# Altium project MainBoard.PrjPcb
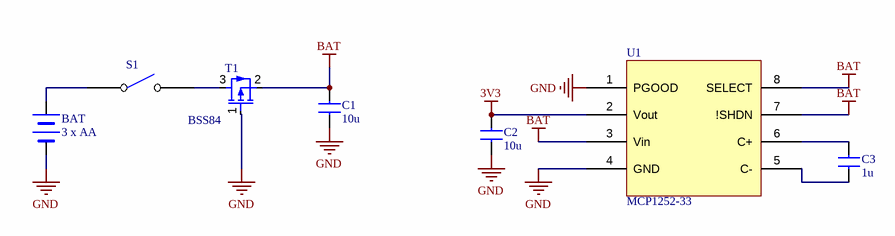
[diagram p0: MainBoard_Power.SchDoc]
5 sheets, 55 parts. Net scope: global (net labels, ports and power ports of the same name join across sheets).
Board file: MainBoard.PcbDoc
Sheets:
  MainBoard_Power.SchDoc
  MainBoard_MCU_RF.SchDoc
  MainBoard_HMI.SchDoc
  MainBoard_Light.SchDoc
  MainBoard_Interface_ProyimityDetector.SchDoc

## Sheet MainBoard_Power.SchDoc: Main Board Power
size A4; DrawnBy: M. Schwegler; Organization: HSLU T&A; Address1: Abteilung Elektrotechnik; Address2: Technikumsstrasse 21; Address3: CH-6048 Horw; Revision: v2; SheetNumber: 1; SheetTotal: 5; Projektname: SmartBoard; DocumentName: Main Board Power

### Parts
BAT  3 x AA  [POWER2]
C1  10u  [0805_C]
C2  10u  [0805_C]
C3  1u  [0805_C]
S1  SW SPST  [SIP2]  (value not drawn)
T1  BSS84  [SOT23-3]
U1  MCP1252-33  [MSOP8]

### Nets
3V3: C2.2 U1.2(Vout)
BAT: C1.2 T1.2(S) U1.3(Vin) U1.7(!SHDN) U1.8(SELECT)
GND: BAT.2 C1.1 C2.1 T1.1(G) U1.1(PGOOD) U1.4(GND)
NetBAT_1: BAT.1 S1.1(COMMON)
NetC3_1: C3.1 U1.5(C-)
NetC3_2: C3.2 U1.6(C+)
NetS1_2: S1.2(NO) T1.3(D)

### Notes on the sheet
- Project:
- Drawn by:
- Size:
- Sheet
- A4
- Rev.:
- of
- Date:
- File:

### Library data of the parts
BAT = BATTERY
C1-C3 = C?: Normaler Kondensator
T1 = MOSFET-P 1G,2D,3S (Diode)
U1 = VOLTREG

## Sheet MainBoard_MCU_RF.SchDoc: Main Board MCU and nRF24L01+
size A4; DrawnBy: M. Schwegler; Organization: HSLU T&A; Address1: Abteilung Elektrotechnik; Address2: Technikumsstrasse 21; Address3: CH-6048 Horw; Revision: v2; SheetNumber: 2; SheetTotal: 5; Projektname: SmartBoard; DocumentName: MainBoard; ProjectName: SmartBoard
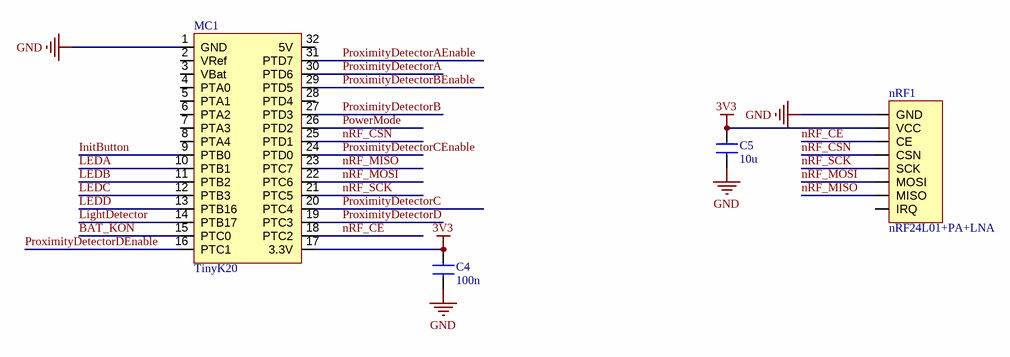
[diagram p1: MainBoard_MCU_RF.SchDoc]

### Parts
C4  100n  [0805_C]
C5  10u  [0805_C]
MC1  TinyK20  [DIP32]
nRF1  nRF24L01+PA+LNA  [CON_THT_2x4P_RM2.54_Stiftl]

### Nets
3V3: C4.2 C5.2 MC1.17(3.3V) nRF1.2(VCC)
GND: C4.1 C5.1 MC1.1(GND) nRF1.1(GND)
BAT_KON: MC1.15(PTC0)
InitButton: MC1.9(PTB0)
LEDA: MC1.10(PTB1)
LEDB: MC1.11(PTB2)
LEDC: MC1.12(PTB3)
LEDD: MC1.13(PTB16)
LightDetector: MC1.14(PTB17)
nRF_CE: MC1.18(PTC2) nRF1.3(CE)
nRF_CSN: MC1.25(PTD1) nRF1.4(CSN)
nRF_MISO: MC1.23(PTC7) nRF1.7(MISO)
nRF_MOSI: MC1.22(PTC6) nRF1.6(MOSI)
nRF_SCK: MC1.21(PTC5) nRF1.5(SCK)
PowerMode: MC1.26(PTD2)
ProximityDetectorA: MC1.30(PTD6)
ProximityDetectorAEnable: MC1.31(PTD7)
ProximityDetectorB: MC1.27(PTD3)
ProximityDetectorBEnable: MC1.29(PTD5)
ProximityDetectorC: MC1.20(PTC4)
ProximityDetectorCEnable: MC1.24(PTD0)
ProximityDetectorD: MC1.19(PTC3)
ProximityDetectorDEnable: MC1.16(PTC1)

Not connected (* = marked no-connect by the designer): MC1 2(VRef) 3(VBat) 4(PTA0) 5(PTA1) 6(PTA2) 7(PTA3) 8(PTA4) 28(PTD4) 32(5V); nRF1 8(IRQ)

### Notes on the sheet
- Project:
- Drawn by:
- Size:
- Sheet
- A4
- Rev.:
- of
- Date:
- File:

### Library data of the parts
C4 C5 = C?: Normaler Kondensator
nRF1 = Bluefruit

## Sheet MainBoard_HMI.SchDoc: Main Board HMI
size A4; DrawnBy: M. Schwegler; Organization: HSLU T&A; Address1: Abteilung Elektrotechnik; Address2: Technikumsstrasse 21; Address3: CH-6048 Horw; Revision: v2; SheetNumber: 3; SheetTotal: 5; Projektname: SmartBoard; DocumentName: MainBoard; ProjectName: SmartBoard
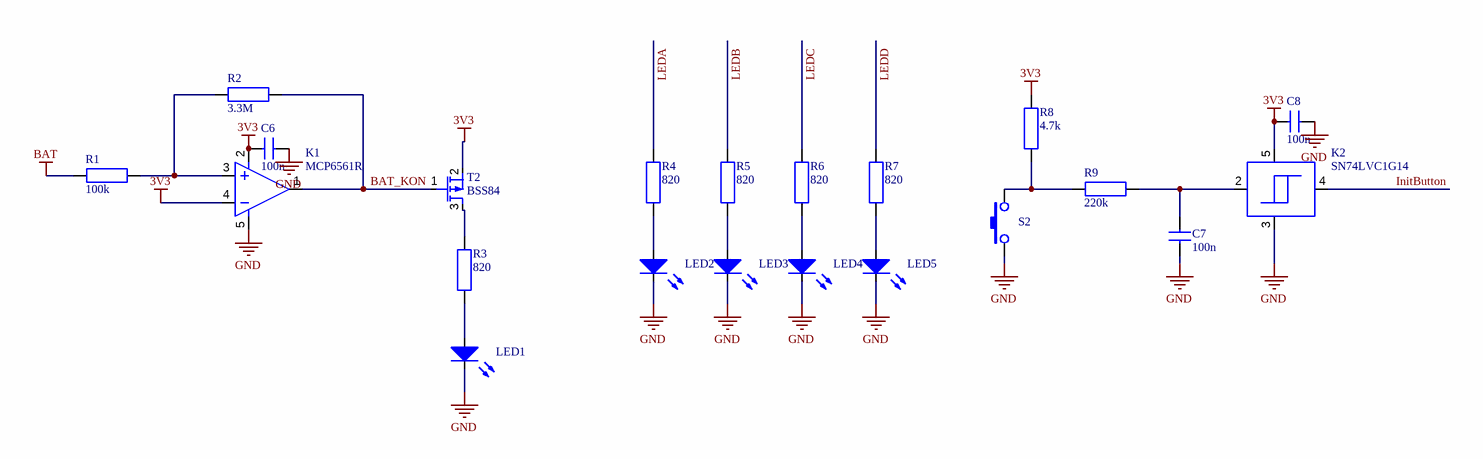
[diagram p2: MainBoard_HMI.SchDoc]

### Parts
C6  100n  [0805_C]
C7  100n  [0805_C]
C8  100n  [0805_C]
K1  MCP6561R  [SOT23-5]
K2  SN74LVC1G14  [SOT23-5]
LED1  (no value)  [LED_THT_3mm_RM_2.54mm]
LED2  (no value)  [LED_THT_3mm_RM_2.54mm]
LED3  (no value)  [LED_THT_3mm_RM_2.54mm]
LED4  (no value)  [LED_THT_3mm_RM_2.54mm]
LED5  (no value)  [LED_THT_3mm_RM_2.54mm]
R1  100k  [0805_R]
R2  3.3M  [0805_R]
R3  820  [0805_R]
R4  820  [0805_R]
R5  820  [0805_R]
R6  820  [0805_R]
R7  820  [0805_R]
R8  4.7k  [0805_R]
R9  220k  [0805_r]
S2  S2  [SIP2]  (value not drawn)
T2  BSS84  [SOT23-3]

### Nets
3V3: C6.1 C8.1 K1.2 K1.4 K2.5 R8.1 T2.2(S)
BAT: R1.2
GND: C6.2 C7.1 C8.2 K1.5 K2.3 LED1.2(K) LED2.2(K) LED3.2(K) LED4.2(K) LED5.2(K) S2.1
BAT_KON: K1.1 R2.1 T2.1(G)
InitButton: K2.4
LEDA: R4.1
LEDB: R5.1
LEDC: R6.1
LEDD: R7.1
NetC7_2: C7.2 K2.2 R9.2
NetK1_3: K1.3 R1.1 R2.2
NetLED1_1: LED1.1(A) R3.2
NetLED2_1: LED2.1(A) R4.2
NetLED3_1: LED3.1(A) R5.2
NetLED4_1: LED4.1(A) R6.2
NetLED5_1: LED5.1(A) R7.2
NetR3_1: R3.1 T2.3(D)
NetR8_2: R8.2 R9.1 S2.2

### Notes on the sheet
- Project:
- Drawn by:
- Size:
- Sheet
- A4
- Rev.:
- of
- Date:
- File:

### Library data of the parts
C6-C8 = C?: Normaler Kondensator
K1 = OPAMP
K2 = schmitt
LED1-LED5 = LED
R1-R9 = R?: Normaler Widerstand
S2 = SW-PB
T2 = MOSFET-P 1D,2G,3S

## Sheet MainBoard_Light.SchDoc: Main Board Light Detector
size A4; DrawnBy: M. Schwegler; Organization: HSLU T&A; Address1: Abteilung Elektrotechnik; Address2: Technikumsstrasse 21; Address3: CH-6048 Horw; Revision: v2; SheetNumber: 4; SheetTotal: 5; Projektname: SmartBoard; DocumentName: MainBoard; ProjectName: SmartBoard
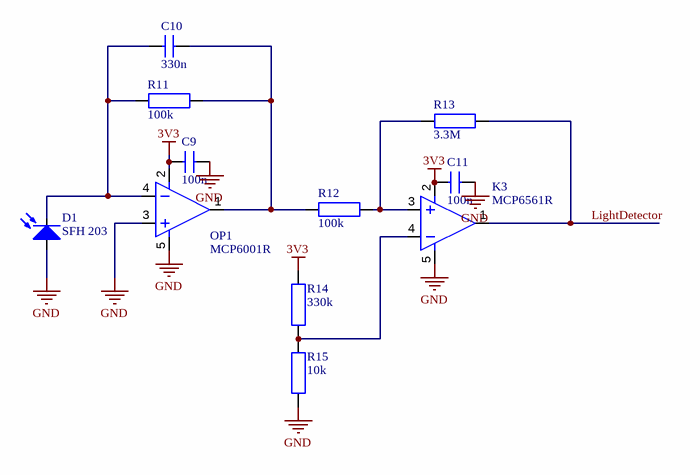
[diagram p3: MainBoard_Light.SchDoc]

### Parts
C9  100n  [0805_C]
C10  330n  [0805_C]
C11  100n  [0805_C]
D1  SFH 203  [LED_THT_5mm_RM_2.54mm]
K3  MCP6561R  [SOT23-5]
OP1  MCP6001R  [SOT23-5]
R11  100k  [0805_R]
R12  100k  [0805_R]
R13  3.3M  [0805_R]
R14  330k  [0805_R]
R15  10k  [0805_R]

### Nets
3V3: C9.1 C11.1 K3.2 OP1.2 R14.1
GND: C9.2 C11.2 D1.1(A) K3.5 OP1.3 OP1.5 R15.2
LightDetector: K3.1 R13.1
NetC10_1: C10.1 D1.2(K) OP1.4 R11.2
NetC10_2: C10.2 OP1.1 R11.1 R12.2
NetK3_3: K3.3 R12.1 R13.2
NetK3_4: K3.4 R14.2 R15.1

### Notes on the sheet
- Project:
- Drawn by:
- Size:
- Sheet
- A4
- Rev.:
- of
- Date:
- File:

### Library data of the parts
C9-C11 = C?: Normaler Kondensator
D1 = Photo_Diode_1A_2K
K3 OP1 = OPAMP
R11-R15 = R?: Normaler Widerstand

## Sheet MainBoard_Interface_ProyimityDetector.SchDoc: Main Board Interface Proximity Detector
size A4; DrawnBy: M. Schwegler; Organization: HSLU T&A; Address1: Abteilung Elektrotechnik; Address2: Technikumsstrasse 21; Address3: CH-6048 Horw; Revision: v2; SheetNumber: 5; SheetTotal: 5; Projektname: SmartBoard; DocumentName: MainBoard; ProjectName: SmartBoard
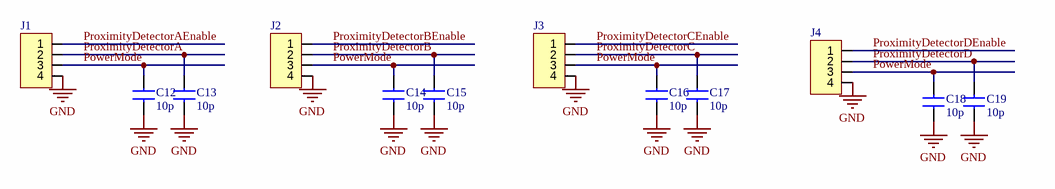
[diagram p4: MainBoard_Interface_ProyimityDetector.SchDoc]

### Parts
C12  10p  [0805_C]
C13  10p  [0805_C]
C14  10p  [0805_C]
C15  10p  [0805_C]
C16  10p  [0805_C]
C17  10p  [0805_C]
C18  10p  [0805_C]
C19  10p  [0805_C]
J1  (no value)  [CON_THT_4P_RM2.54]
J2  (no value)  [CON_THT_4P_RM2.54]
J3  (no value)  [CON_THT_4P_RM2.54]
J4  (no value)  [CON_THT_4P_RM2.54]

### Nets
GND: C12.1 C13.1 C14.1 C15.1 C16.1 C17.1 C18.1 C19.1 J1.4 J2.4 J3.4 J4.4
PowerMode: C12.2 C14.2 C16.2 C18.2 J1.3 J2.3 J3.3 J4.3
ProximityDetectorA: C13.2 J1.2
ProximityDetectorAEnable: J1.1
ProximityDetectorB: C15.2 J2.2
ProximityDetectorBEnable: J2.1
ProximityDetectorC: C17.2 J3.2
ProximityDetectorCEnable: J3.1
ProximityDetectorD: C19.2 J4.2
ProximityDetectorDEnable: J4.1

### Notes on the sheet
- Project:
- Drawn by:
- Size:
- Sheet
- A4
- Rev.:
- of
- Date:
- File:

### Library data of the parts
C12-C19 = C?: Normaler Kondensator
J1-J4 = CON_4P

## Nets that join several sheets
3V3: MainBoard_Power (C2.2 U1.2), MainBoard_MCU_RF (C4.2 C5.2 MC1.17 nRF1.2), MainBoard_HMI (7 pins), MainBoard_Light (5 pins)
BAT: MainBoard_Power (5 pins), MainBoard_HMI (R1.2)
GND: MainBoard_Power (6 pins), MainBoard_MCU_RF (C4.1 C5.1 MC1.1 nRF1.1), MainBoard_HMI (11 pins), MainBoard_Light (7 pins), MainBoard_Interface_ProyimityDetector (12 pins)
BAT_KON: MainBoard_MCU_RF (MC1.15), MainBoard_HMI (K1.1 R2.1 T2.1)
InitButton: MainBoard_MCU_RF (MC1.9), MainBoard_HMI (K2.4)
LEDA: MainBoard_MCU_RF (MC1.10), MainBoard_HMI (R4.1)
LEDB: MainBoard_MCU_RF (MC1.11), MainBoard_HMI (R5.1)
LEDC: MainBoard_MCU_RF (MC1.12), MainBoard_HMI (R6.1)
LEDD: MainBoard_MCU_RF (MC1.13), MainBoard_HMI (R7.1)
LightDetector: MainBoard_MCU_RF (MC1.14), MainBoard_Light (K3.1 R13.1)
PowerMode: MainBoard_MCU_RF (MC1.26), MainBoard_Interface_ProyimityDetector (8 pins)
ProximityDetectorA: MainBoard_MCU_RF (MC1.30), MainBoard_Interface_ProyimityDetector (C13.2 J1.2)
ProximityDetectorAEnable: MainBoard_MCU_RF (MC1.31), MainBoard_Interface_ProyimityDetector (J1.1)
ProximityDetectorB: MainBoard_MCU_RF (MC1.27), MainBoard_Interface_ProyimityDetector (C15.2 J2.2)
ProximityDetectorBEnable: MainBoard_MCU_RF (MC1.29), MainBoard_Interface_ProyimityDetector (J2.1)
ProximityDetectorC: MainBoard_MCU_RF (MC1.20), MainBoard_Interface_ProyimityDetector (C17.2 J3.2)
ProximityDetectorCEnable: MainBoard_MCU_RF (MC1.24), MainBoard_Interface_ProyimityDetector (J3.1)
ProximityDetectorD: MainBoard_MCU_RF (MC1.19), MainBoard_Interface_ProyimityDetector (C19.2 J4.2)
ProximityDetectorDEnable: MainBoard_MCU_RF (MC1.16), MainBoard_Interface_ProyimityDetector (J4.1)